# EAGLE design paper_tape (EAGLE 6.5.0)
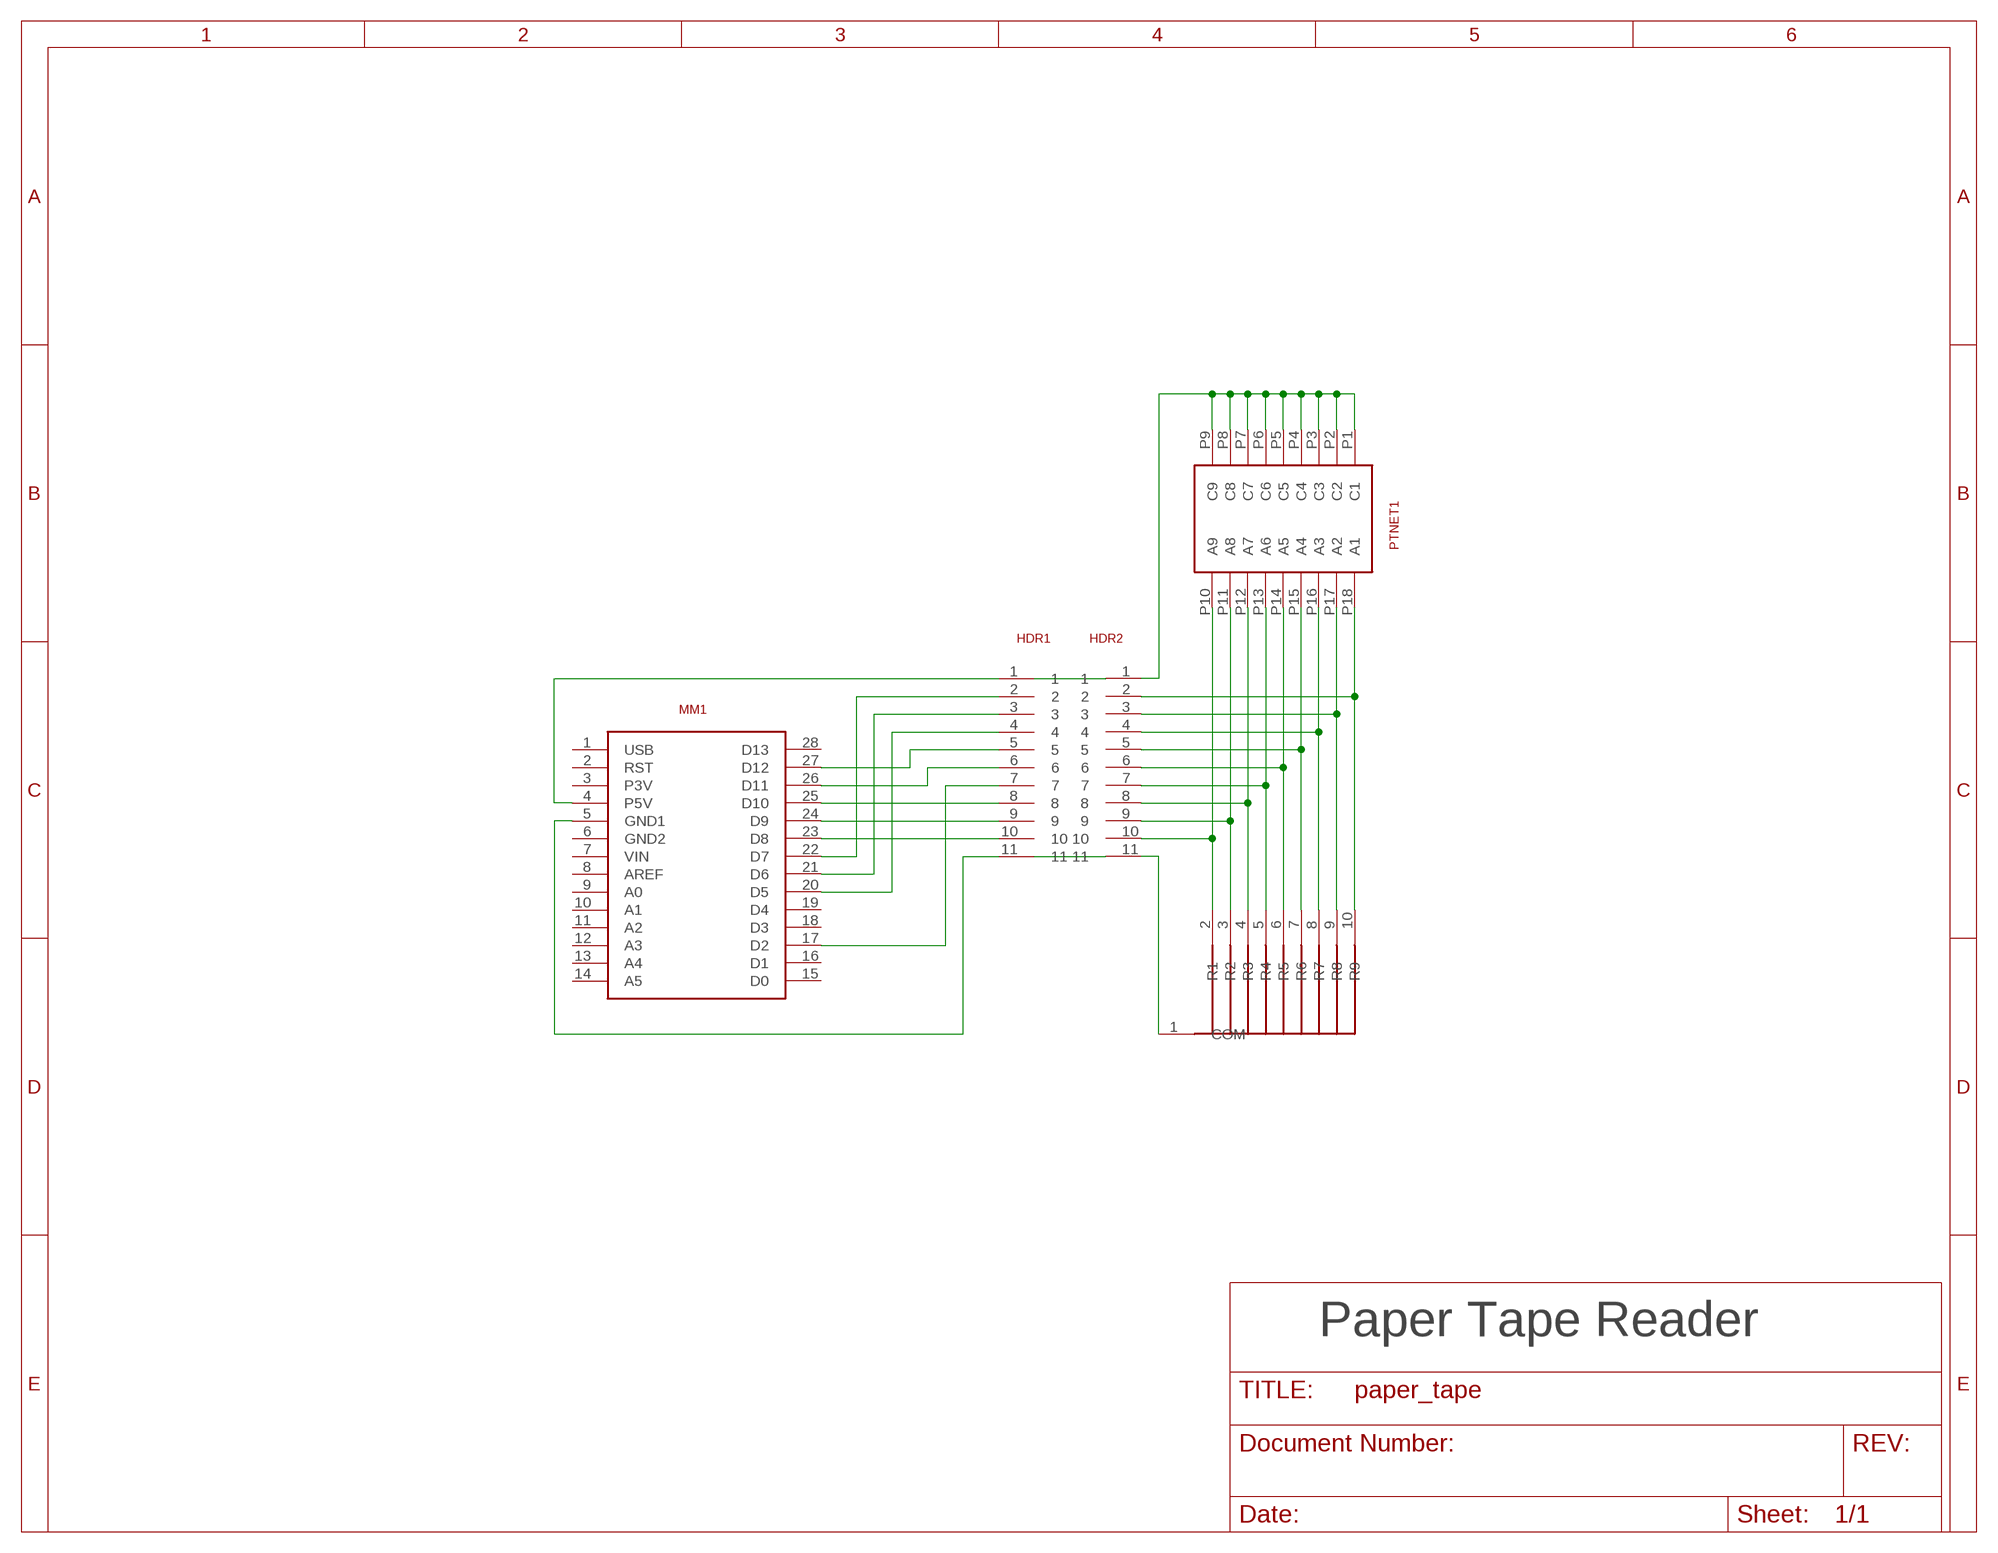
[diagram p0: schematic, sheet 1]

## Parts
HDR1  HEADER  [SIP11]
HDR2  HEADER  [SIP11]
MM1  METRO_MINI  [DIP28]
PTNET1  PBX89  [DIP18N]
RN1  1k  RNET  [SIP10]

## Nets
GND: HDR1.11 HDR2.11 MM1.5(GND1) RN1.1(COM)
N$2: HDR1.7 MM1.17(D2)
N$3: HDR1.6 MM1.26(D11)
N$4: HDR1.5 MM1.27(D12)
N$5: HDR1.4 MM1.20(D5)
N$6: HDR1.3 MM1.21(D6)
N$7: HDR1.2 MM1.22(D7)
N$8: HDR1.1 MM1.4(P5V)
N$9: HDR1.8 MM1.25(D10)
N$10: HDR1.9 MM1.24(D9)
N$11: HDR1.10 MM1.23(D8)
P5V: HDR2.1 PTNET1.P1(C1) PTNET1.P2(C2) PTNET1.P3(C3) PTNET1.P4(C4) PTNET1.P5(C5) PTNET1.P6(C6) PTNET1.P7(C7) PTNET1.P8(C8) PTNET1.P9(C9)
PT_D0: HDR2.10 PTNET1.P10(A9) RN1.2(R1)
PT_D1: HDR2.9 PTNET1.P11(A8) RN1.3(R2)
PT_D2: HDR2.8 PTNET1.P12(A7) RN1.4(R3)
PT_D3: HDR2.6 PTNET1.P14(A5) RN1.6(R5)
PT_D4: HDR2.5 PTNET1.P15(A4) RN1.7(R6)
PT_D5: HDR2.4 PTNET1.P16(A3) RN1.8(R7)
PT_D6: HDR2.3 PTNET1.P17(A2) RN1.9(R8)
PT_D7: HDR2.2 PTNET1.P18(A1) RN1.10(R9)
PT_STROBE: HDR2.7 PTNET1.P13(A6) RN1.5(R4)
Unconnected: MM1.1(USB) MM1.2(RST) MM1.3(P3V) MM1.6(GND2) MM1.7(VIN) MM1.8(AREF) MM1.9(A0) MM1.10(A1) MM1.11(A2) MM1.12(A3) MM1.13(A4) MM1.14(A5) MM1.15(D0) MM1.16(D1) MM1.18(D3) MM1.19(D4) MM1.28(D13)

## Notes on the sheet
- Paper Tape Reader

## Library data of the parts
HDR1 HDR2 = paper_tape:HEADER: 11-pin header
MM1 = paper_tape:METRO_MINI: Adafruit Metro Mini Arduino. ATmega328 + FTDI USB Serial
PTNET1 = paper_tape:PBX89: PBX89 - 9 Photodiode Array
RN1 = paper_tape:RNET: Resistor Network

## Board
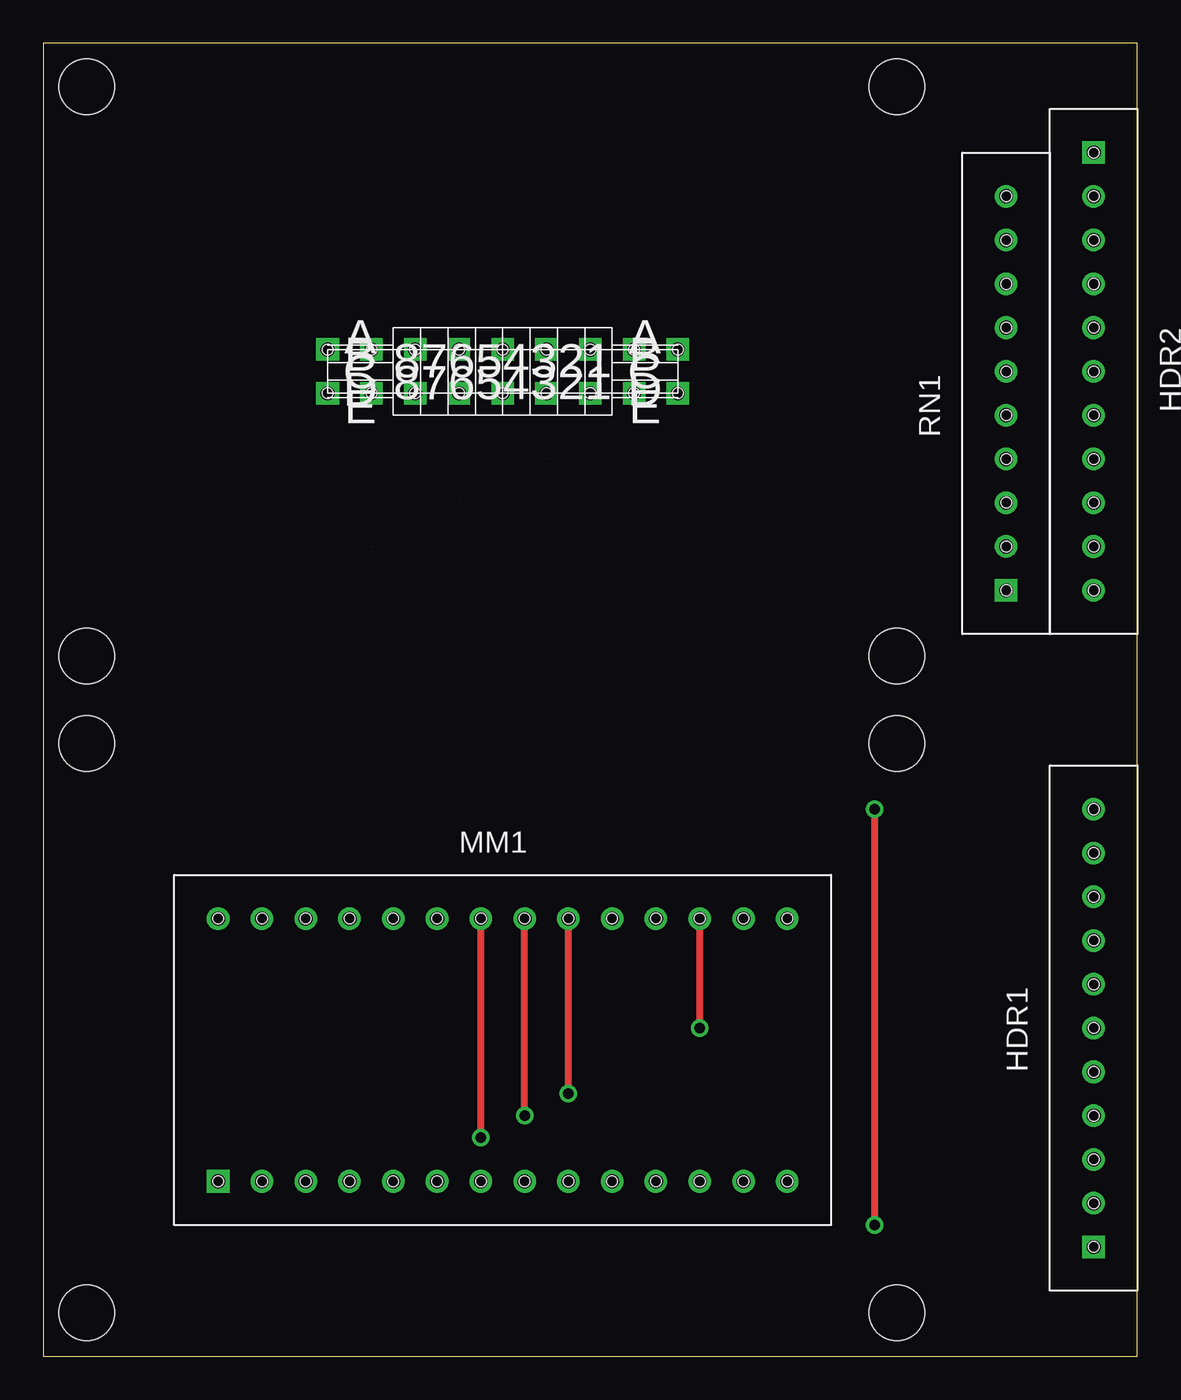
[diagram p1: board, top side]
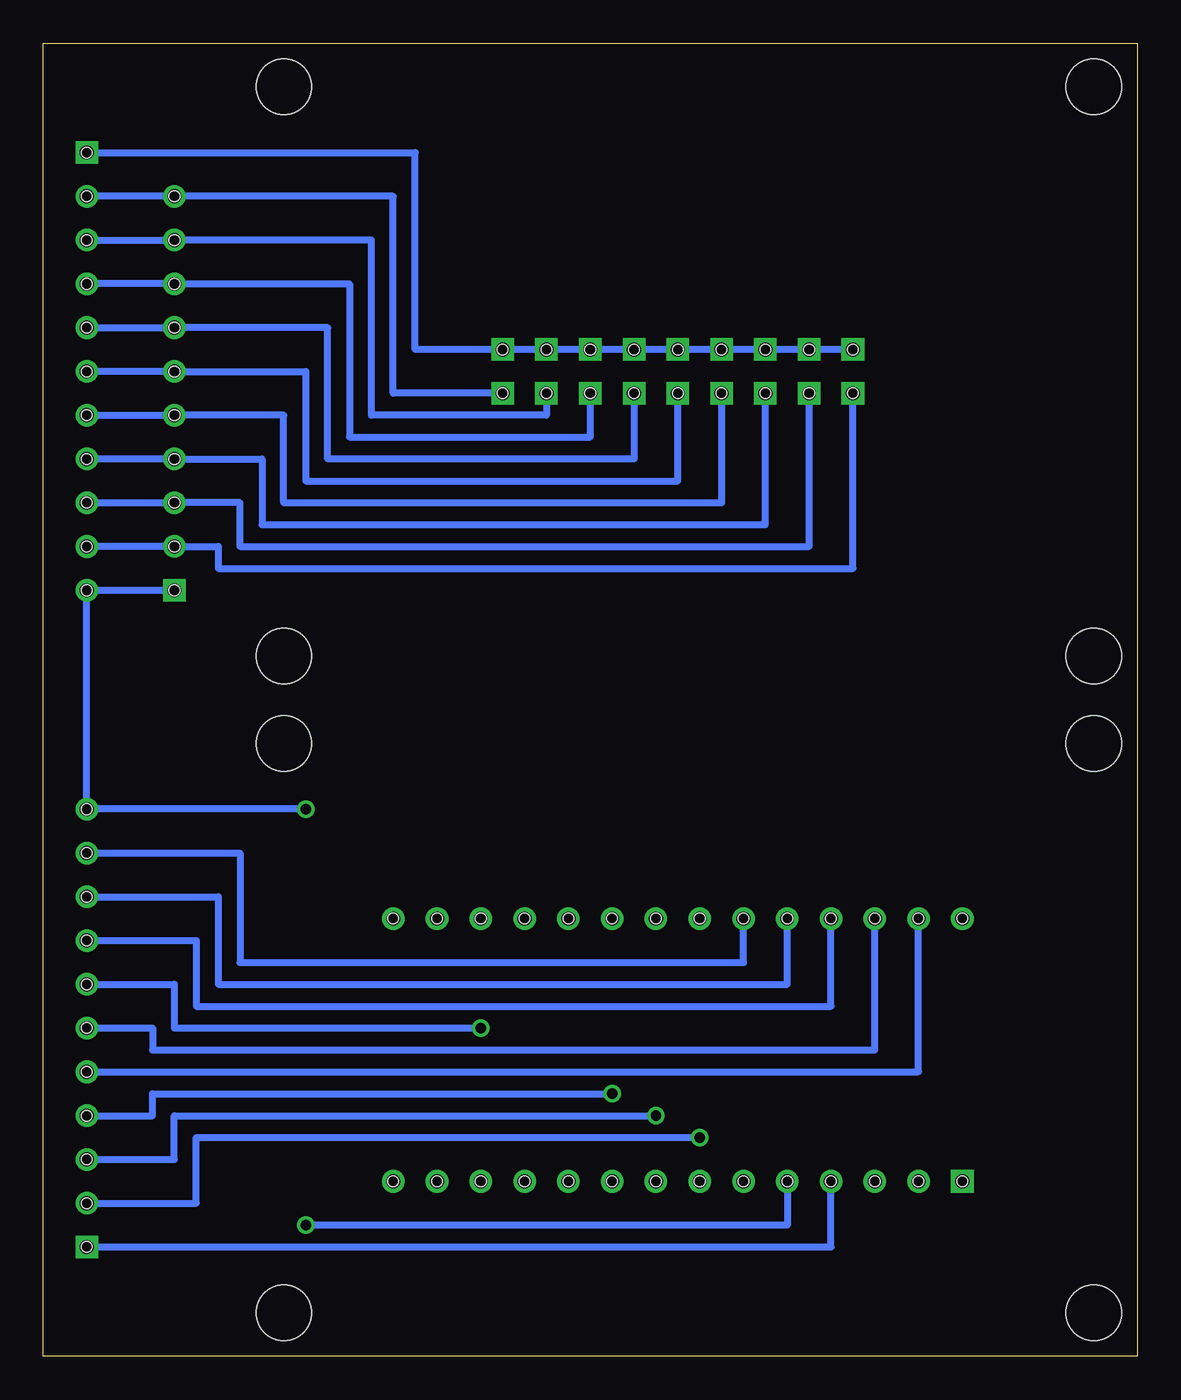
[diagram p2: board, bottom side, seen from below]

Size 63.5 x 76.2 mm. Coordinates in mm from the lower left corner, seen from the top.
Outline: 0,0 63.5,0 63.5,76.2 0,76.2 0,0
Copper layers (1*16): Top 0.035mm / dielectric 1.5mm / Bottom 0.035mm
Design rules "default": minimum track width 10mil, minimum drill 24mil, track to track 8mil, track to pad 8mil, pad to pad 8mil, via to via 8mil, smd to smd 8mil, copper to edge 40mil, drill to drill 8mil, minimum pad ring 10mil, minimum via ring 8mil, stop-mask expansion 4mil, vias tented up to drill 0mil, thermal gap 10mil
Holes 3.2 mm at 2.54,73.66 2.54,2.54 2.54,35.56 2.54,40.64 49.53,2.54 49.53,35.56 49.53,40.64 49.53,73.66

### Footprints (pad centres in the part's own frame; a part is rotated, then mirrored left to right if it is on the bottom)
SIP11 = drill 0.8 square: 1 -12.7,0 | drill 0.8: 2 -10.16,0; 3 -7.62,0; 4 -5.08,0; 5 -2.54,0; 6 0,0; 7 2.54,0; 8 5.08,0; 9 7.62,0; 10 10.16,0; 11 12.7,0 | hole 0.6: -12.7,0; -10.16,0; -7.62,0; -5.08,0; -2.54,0; 0,0; 2.54,0; 5.08,0; 7.62,0; 10.16,0; 12.7,0
DIP28 = drill 0.8 square: 1 -17.78,-7.62 | drill 0.8: 2 -15.24,-7.62; 3 -12.7,-7.62; 4 -10.16,-7.62; 5 -7.62,-7.62; 6 -5.08,-7.62; 7 -2.54,-7.62; 8 0,-7.62; 9 2.54,-7.62; 10 5.08,-7.62; 11 7.62,-7.62; 12 10.16,-7.62; 13 12.7,-7.62; 14 15.24,-7.62; 15 15.24,7.62; 16 12.7,7.62; 17 10.16,7.62; 18 7.62,7.62; 19 5.08,7.62; 20 2.54,7.62; 21 0,7.62; 22 -2.54,7.62; 23 -5.08,7.62; 24 -7.62,7.62; 25 -10.16,7.62; 26 -12.7,7.62; 27 -15.24,7.62; 28 -17.78,7.62; P$1 -12.7,-7.62 | hole 0.6: -17.78,-7.62; -15.24,-7.62; -12.7,-7.62; -10.16,-7.62; -7.62,-7.62; -5.08,-7.62; -2.54,-7.62; 0,-7.62; 2.54,-7.62; 5.08,-7.62; 7.62,-7.62; 10.16,-7.62; 12.7,-7.62; 15.24,-7.62; 15.24,7.62; 12.7,7.62; 10.16,7.62; 7.62,7.62; 5.08,7.62; 2.54,7.62; 0,7.62; -2.54,7.62; -5.08,7.62; -7.62,7.62; -10.16,7.62; -12.7,7.62; -15.24,7.62; -17.78,7.62
DIP18N = drill 0.8 square: P1 -10.16,-1.27; P2 -7.62,-1.27; P3 -5.08,-1.27; P4 -2.54,-1.27; P5 0,-1.27; P6 2.54,-1.27; P7 5.08,-1.27; P8 7.62,-1.27; P9 10.16,-1.27; P10 10.16,1.27; P11 7.62,1.27; P12 5.08,1.27; P13 2.54,1.27; P14 0,1.27; P15 -2.54,1.27; P16 -5.08,1.27; P17 -7.62,1.27; P18 -10.16,1.27 | hole 0.6: 0,1.27; -2.54,1.27; -5.08,1.27; -7.62,1.27; -10.16,1.27; -10.16,-1.27; -7.62,-1.27; -5.08,-1.27; -2.54,-1.27; 0,-1.27; 2.54,-1.27; 2.54,1.27; 5.08,1.27; 7.62,1.27; 10.16,1.27; 10.16,-1.27; 7.62,-1.27; 5.08,-1.27
SIP10 = drill 0.8 square: 1 -10.16,0 | drill 0.8: 2 -7.62,0; 3 -5.08,0; 4 -2.54,0; 5 0,0; 6 2.54,0; 7 5.08,0; 8 7.62,0; 9 10.16,0; 10 12.7,0 | hole 0.6: -10.16,0; -7.62,0; -5.08,0; -2.54,0; 0,0; 2.54,0; 5.08,0; 7.62,0; 10.16,0; 12.7,0

### Placement (x,y rotation side)
HDR1  60.96,19.05 90 top
HDR2  60.96,57.15 270 top
MM1  27.94,17.78 0 top
PTNET1  26.67,57.15 180 top
RN1  55.88,54.61 90 top

### Tracks (layer width: path | path; a pad name or v marks a point on that pad's centre or on a via)
GND  (via drill 0.6)
  Top 0.406: v48.26,7.62 v48.26,31.75
  Bottom 0.406: MM1.5 20.32,7.62 v48.26,7.62 | RN1.1 HDR2.11 HDR1.11 v48.26,31.75
N$2  (via drill 0.6)
  Top 0.406: v38.1,19.05 MM1.17
  Bottom 0.406: HDR1.7 55.88,21.59 55.88,19.05 v38.1,19.05
N$3
  Bottom 0.406: HDR1.6 57.15,19.05 57.15,17.78 15.24,17.78 MM1.26
N$4
  Bottom 0.406: HDR1.5 12.7,16.51 MM1.27
N$5  (via drill 0.6)
  Top 0.406: v30.48,15.24 MM1.20
  Bottom 0.406: HDR1.4 57.15,13.97 57.15,15.24 v30.48,15.24
N$6  (via drill 0.6)
  Top 0.406: v27.94,13.97 MM1.21
  Bottom 0.406: HDR1.3 55.88,11.43 55.88,13.97 v27.94,13.97
N$7  (via drill 0.6)
  Top 0.406: v25.4,12.7 MM1.22
  Bottom 0.406: HDR1.2 54.61,8.89 54.61,12.7 v25.4,12.7
N$8
  Bottom 0.406: HDR1.1 17.78,6.35 MM1.4
N$9
  Bottom 0.406: HDR1.8 54.61,24.13 54.61,20.32 17.78,20.32 MM1.25
N$10
  Bottom 0.406: HDR1.9 53.34,26.67 53.34,21.59 20.32,21.59 MM1.24
N$11
  Bottom 0.406: HDR1.10 52.07,29.21 52.07,22.86 22.86,22.86 MM1.23
P5V
  Bottom 0.406: PTNET1.P9 PTNET1.P8 PTNET1.P7 PTNET1.P6 PTNET1.P5 PTNET1.P4 PTNET1.P3 PTNET1.P2 PTNET1.P1 41.91,58.42 41.91,69.85 HDR2.1
PT_D0
  Bottom 0.406: HDR2.10 RN1.2 53.34,46.99 53.34,45.72 16.51,45.72 PTNET1.P10
PT_D1  (1 unrouted)
  Bottom 0.406: PTNET1.P11 19.05,46.99 52.07,46.99 52.07,49.53 RN1.3 HDR2.9
PT_D2
  Bottom 0.406: HDR2.8 RN1.4 50.8,52.07 50.8,48.26 21.59,48.26 PTNET1.P12
PT_D3
  Bottom 0.406: HDR2.6 RN1.6 48.26,57.15 48.26,50.8 26.67,50.8 PTNET1.P14
PT_D4  (1 unrouted)
  Bottom 0.406: PTNET1.P15 29.21,52.07 46.99,52.07 46.99,59.69 RN1.7 HDR2.5
PT_D5
  Bottom 0.406: HDR2.4 RN1.8 45.72,62.23 45.72,53.34 31.75,53.34 PTNET1.P16
PT_D6  (1 unrouted)
  Bottom 0.406: PTNET1.P17 34.29,54.61 44.45,54.61 44.45,64.77 RN1.9 HDR2.3
PT_D7
  Bottom 0.406: PTNET1.P18 43.18,55.88 43.18,67.31 RN1.10 HDR2.2
PT_STROBE  (1 unrouted)
  Bottom 0.406: PTNET1.P13 24.13,49.53 49.53,49.53 49.53,54.61 RN1.5 HDR2.7